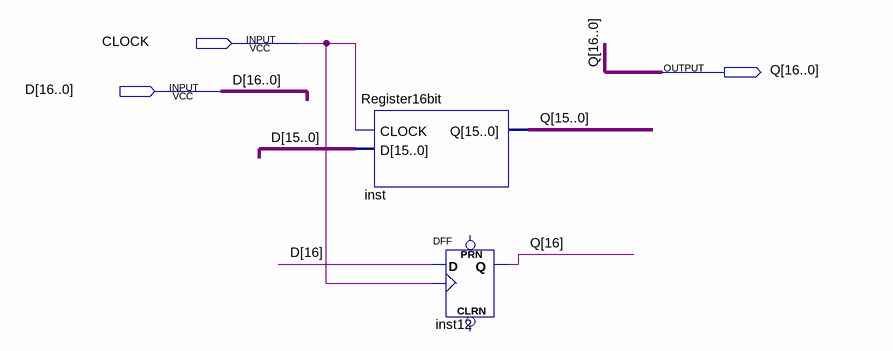
[diagram p0: schematic sheet]
// Quartus schematic Register17bit.bdf as structural Verilog: 2 symbols, 3 pins
module Register17bit (
  input  CLOCK,
  input  [16:0] D,
  output [16:0] Q
);

  Register16bit inst (.CLOCK(CLOCK), .D(D[15:0]), .Q(Q[15:0]));
  DFF inst12 (.CLK(CLOCK), .D(D[16]), .Q(Q[16]));  // open: CLRN, PRN
endmodule
